# Altium schematic sheet CHIBI_BT_20181126.SchDoc: Title
size A2; PageSetup: Record=PageOptions|CenterHorizontal=True|CenterVertical=True|PrintScale=0.47|XCorrection=1.00|YCorrection=1.00|PrintKind=1|BorderSize=5000000|LeftOffset=0|BottomOffset=0|Orientation=2|PaperLength=1000|PaperWidth=1000|Scale=100|PaperSource=7|PrintQuality=-3|MediaType=1|DitherType=10|PrintScaleMode=1|PaperKind=Letter|PaperIndex=1; ApprovedBy: Enter Name; CheckedBy: Enter Name; DrawnBy: Enter Name; Organization: Tymphany; Address1: 2/F, BBK Building; Address2: No. 89 Ande Street, Shang Meilin; Address3: Futian District, Shenzhen; Address4: GuangDong, P.R.C. 518049, China; DocumentNumber: 3; Revision: 0.0.0; SheetNumber: 3; SheetTotal: 6; ProductName: Product Name; PartNumber: Part Number; ModifiedBy: Enter Name; LeadEngineer: Enter Name; Stage: Concept; DCR: 238m幐嶰WNERINDEX=4425; ProjectName: Project Name
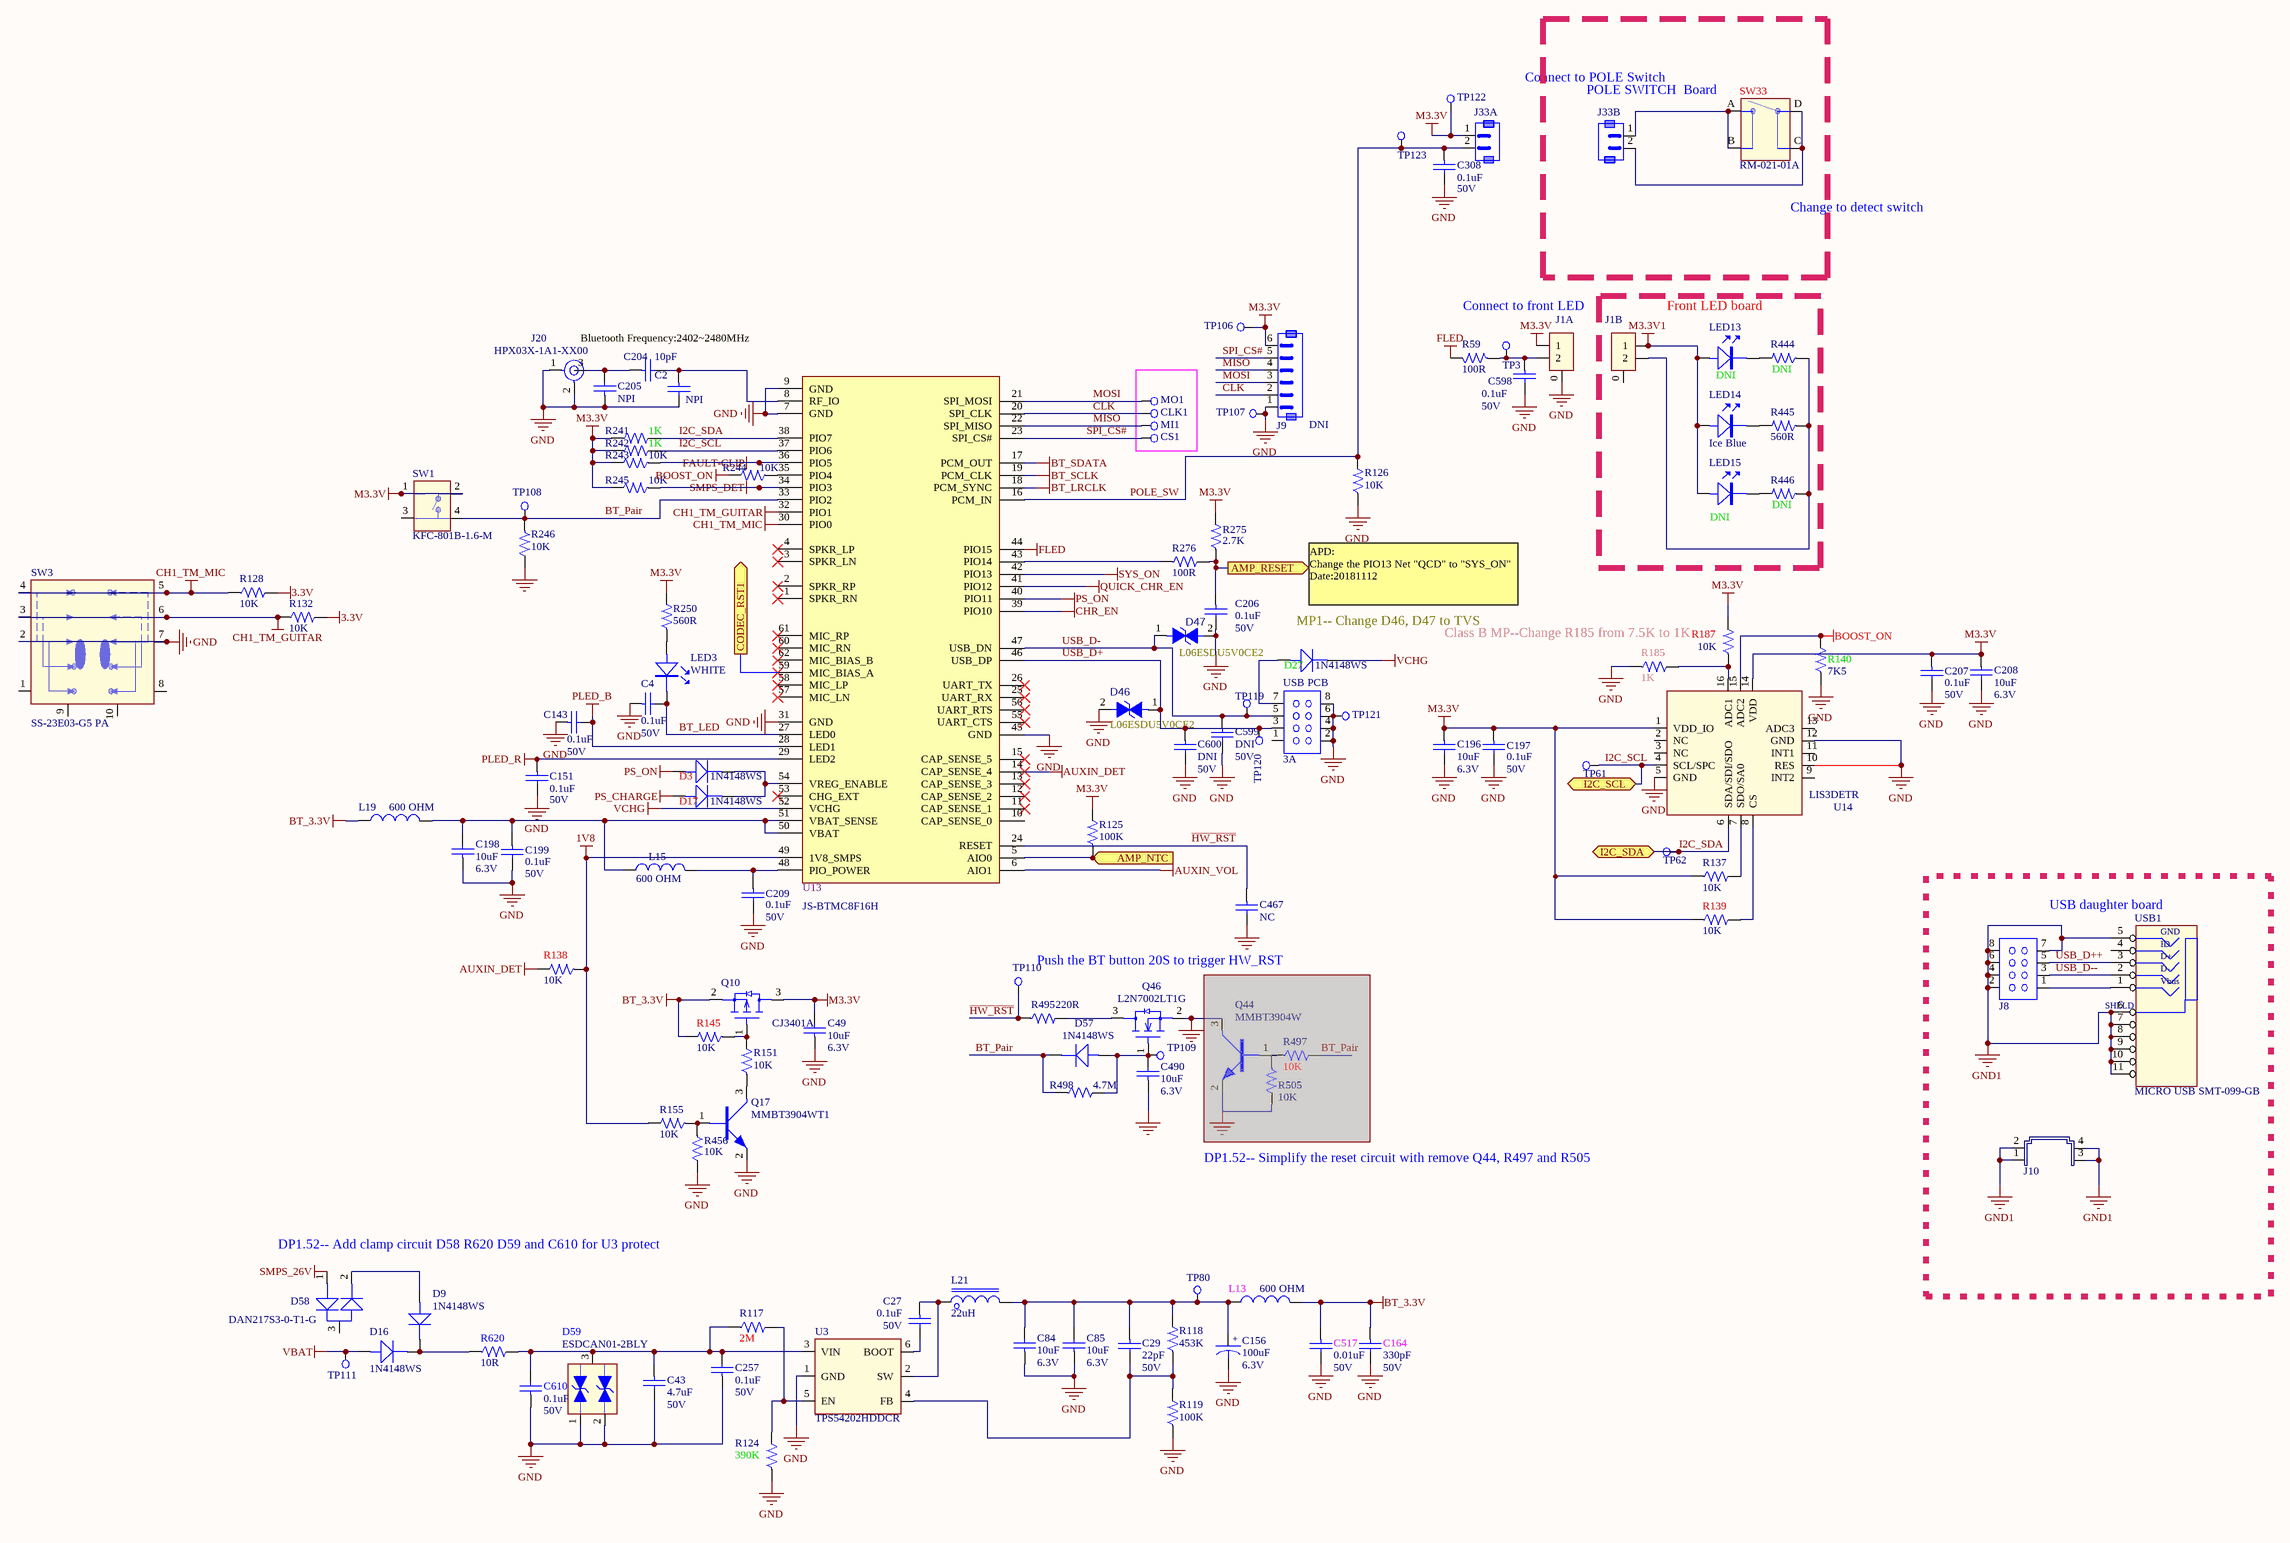
[diagram p0: CHIBI_BT_20181126.SchDoc]

## Parts
C2  value NPI  [CAPC0402-RW]  (hidden comment: PWL410371-1000)
C4  value 0.1uF  Voltage: 50V  [CAPC0402-RW]  (hidden comment: PWL456470-1040)
C27  value 0.1uF  Voltage: 50V  [CAPC0603-RW]  (hidden comment: PXL456470-1040)
C29  value 22pF  Voltage: 50V  [CAPC0402-RW]  (hidden comment: PWL410370-2200)
C43  value 4.7uF  Voltage: 50V  [CAPC0805-RW]  (hidden comment: PYL456470-4750)
C49  value 10uF  Voltage: 6.3V  [CAPC0603-RW]  (hidden comment: PXL426521-1060)
C84  value 10uF  Voltage: 6.3V  [CAPC0603-RW]  (hidden comment: PXL426521-1060)
C85  value 10uF  Voltage: 6.3V  [CAPC0603-RW]  (hidden comment: PXL426521-1060)
C143  value 0.1uF  Voltage: 50V  [CAPC0402-RW]  (hidden comment: PWL456470-1040)
C151  value 0.1uF  Voltage: 50V  [CAPC0402-RW]  (hidden comment: PWL456470-1040)
C156  value 100uF  Voltage: 6.3V  [CASE - C]  (hidden comment: PBE099520-1010)
C164  value 330pF  Voltage: 50V  [CAPC0402-RW]  (hidden comment: PWL410371-3310)
C196  value 10uF  Voltage: 6.3V  [CAPC0603-RW]  (hidden comment: PXL426521-1060)
C197  value 0.1uF  Voltage: 50V  [CAPC0402-RW]  (hidden comment: PWL456470-1040)
C198  value 10uF  Voltage: 6.3V  [CAPC0603-RW]  (hidden comment: PXL426521-1060)
C199  value 0.1uF  Voltage: 50V  [CAPC0402-RW]  (hidden comment: PWL456470-1040)
C204  value 10pF  [CAPC0402-RW]  (hidden comment: PWL410371-1000)
C205  value NPI  [CAPC0402-RW]  (hidden comment: PWL410371-1000)
C206  value 0.1uF  Voltage: 50V  [CAPC0603-RW]  (hidden comment: PXL456470-1040)
C207  value 0.1uF  Voltage: 50V  [CAPC0402-RW]  (hidden comment: PWL456470-1040)
C208  value 10uF  Voltage: 6.3V  [CAPC0603-RW]  (hidden comment: PXL426521-1060)
C209  value 0.1uF  Voltage: 50V  [CAPC0402-RW]  (hidden comment: PWL456470-1040)
C257  value 0.1uF  Voltage: 50V  [CAPC0603-RW]  (hidden comment: PXL456470-1040)
C308  value 0.1uF  Voltage: 50V  [CAPC0402-RW]  (hidden comment: PWL456470-1040)
C467  value NC  [CAPC0402-RW]  (hidden comment: PWL456450-1040)
C490  value 10uF  Voltage: 6.3V  [CAPC0603-RW]  (hidden comment: PXL426521-1060)
C517  value 0.01uF  Voltage: 50V  [CAPC0402-RW]  (hidden comment: PWL456470-1030)
C598  value 0.1uF  Voltage: 50V  [CAPC0402-RW]  (hidden comment: PWL456470-1040)
C599  value DNI  Voltage: 50V  [CAPC0402-RW]  (hidden comment: T54000000484E)
C600  value DNI  Voltage: 50V  [CAPC0402-RW]  (hidden comment: T54000000484E)
C610  value 0.1uF  Voltage: 50V  [CAPC0603-RW]  (hidden comment: PXL456470-1040)
CLK1  TP  [TP_1.5mm]  (value not drawn)
CS1  TP  [TP_1.5mm]  (value not drawn)
D3  RCD114148-0020  [SOD-323]  (value not drawn)
D9  RCD114148-0020  [SOD-323]  (value not drawn)
D16  RCD114148-0020  [SOD-323]  (value not drawn)
D17  RCD114148-0020  [SOD-323]  (value not drawn)
D27  RCD114148-0020  [SOD-323]  (value not drawn)
D46  T593000120100  [SOD882-ESD]  (value not drawn)
D47  T593000120100  [SOD882-ESD]  (value not drawn)
D57  RCD114148-0020  [SOD-323]  (value not drawn)
D58  T572006171251  [SOT323(SC-70)-R]  (value not drawn)
D59  RCD100012-0001  [SOT23-132-RW]  (value not drawn)
J1A  T690300109100  [CONN 2P PH=2.0mm ST SMT PH-2AT-JK]  (value not drawn)
J1B  T690300109100  [CONN 2P PH=2.0mm ST SMT PH-2AT-JK]  (value not drawn)
J8  T690300110000  [HEAD 8P 2X4 PH=2.54mm 90 H5mm_2.54-2X4AW-10.4]  (value not drawn)
J9  value DNI  [CONN 6P PH=1.5mm ST SMT ZH-6AT-JK]  (hidden comment: T690300087900)
J10  T130149800100  [USB BRACKET SPTE NATUR CLEAN]  (value not drawn)
J20  MFG Part: HPX03X-1A1-XX00  [IPEX CONN HPX03X-1A1-XX00]  (hidden comment: COT130017-0001)
J33A  T690300108700  [CONN 2P PH=1.5MM SMT 180 ZH-2AT-JK]  (value not drawn)
J33B  T690300108700  [CONN 2P PH=1.5MM SMT 180 ZH-2AT-JK]  (value not drawn)
L13  Impedence: 600 OHM  [L0402-RW]  (hidden comment: T710500014900)
L15  Impedence: 600 OHM  [L0402-RW]  (hidden comment: T710500014900)
L19  Impedence: 600 OHM  [L0402-RW]  (hidden comment: T710500014900)
L21  value 22uH  [GPSR0550-220M]  (hidden comment: T621000054100)
LED3  Color: WHITE  [LED0603_WHITE]  (hidden comment: KCD900603-0070)
LED13  SAP: DNI  [LED0805-Blue]  (hidden comment: T575011290263)
LED14  Color: Ice Blue  [LED0805-Blue]  (hidden comment: T575011290263)
LED15  SAP: DNI  [LED0805-Blue]  (hidden comment: T575011290263)
MI1  TP  [TP_1.5mm]  (value not drawn)
MO1  TP  [TP_1.5mm]  (value not drawn)
Q10  T585002530466  [SOT23-132-RW]  (value not drawn)
Q17  T581003992440  [SOT323(SC-70)-R]  (value not drawn)
Q44  T581004022460  [SOT323(SC-70)-R]  (value not drawn)  (masked out: inside a compile mask, not in the netlist)
Q46  RCM207002-1001  [SOT23-132-RW]  (value not drawn)
R59  value 100R  [0603-RW]  (hidden comment: QCF011030-1000)
R117  value 2M  [0402-RW]  (hidden comment: T502200401399)
R118  value 453K  [0402-RW]  (hidden comment: T502453301399)
R119  value 100K  [0603-RW]  (hidden comment: QCF011030-1003)
R124  value 390K  [0402-RW]  (hidden comment: QCF161240-3903)
R125  value 100K  [0402-RW]  (hidden comment: QCF161240-1003)
R126  value 10K  [0402-RW]  (hidden comment: QCF161240-1002)
R128  value 10K  [0402-RW]  (hidden comment: QCF161240-1002)
R132  value 10K  [0402-RW]  (hidden comment: QCF161240-1002)
R137  value 10K  [0402-RW]  (hidden comment: QCF161240-1002)
R138  value 10K  [0402-RW]  (hidden comment: QCF161240-1002)
R139  value 10K  [0402-RW]  (hidden comment: QCF161240-1002)
R140  value 7K5  [0402-RW]  (hidden comment: T502750101399)
R145  value 10K  [0402-RW]  (hidden comment: QCF161240-1002)
R151  value 10K  [0402-RW]  (hidden comment: QCF161240-1002)
R155  value 10K  [0402-RW]  (hidden comment: QCF161240-1002)
R185  value 1K  [0402-RW]  (hidden comment: QCF161240-1001)
R187  value 10K  [0402-RW]  (hidden comment: QCF161240-1002)
R241  value 1K  [0402-RW]  (hidden comment: QCF161240-1001)
R242  value 1K  [0402-RW]  (hidden comment: QCF161240-1001)
R243  value 10K  [0402-RW]  (hidden comment: QCF161240-1002)
R244  value 10K  [0402-RW]  (hidden comment: QCF161240-1002)
R245  value 10K  [0402-RW]  (hidden comment: QCF161240-1002)
R246  value 10K  [0402-RW]  (hidden comment: QCF161240-1002)
R250  value 560R  [0603-RW]  (hidden comment: QCF011030-5600)
R275  value 2.7K  [0402-RW]  (hidden comment: QCF161240-2701)
R276  value 100R  [0402-RW]  (hidden comment: QCF161240-1000)
R444  SAP: DNI  [0603-RW]  (hidden comment: QCF011030-5600)
R445  value 560R  [0603-RW]  (hidden comment: QCF011030-5600)
R446  SAP: DNI  [0603-RW]  (hidden comment: QCF011030-5600)
R456  value 10K  [0402-RW]  (hidden comment: QCF161240-1002)
R495  value 220R  [0402-RW]  (hidden comment: QCF161240-2200)
R497  value 10K  [0402-RW]  (hidden comment: QCF161240-1002)  (masked out: inside a compile mask, not in the netlist)
R498  value 4.7M  [0603-RW]  (hidden comment: QCF011030-4704)
R505  value 10K  [0402-RW]  (hidden comment: QCF161240-1002)  (masked out: inside a compile mask, not in the netlist)
R620  value 10R  [0402-RW]  (hidden comment: QCF161241-1009)
SW1  MCWA06007-0010  [KFC-801B-1.6-M]  (value not drawn)
SW3  T670600002700  [SS-23E03-G5 PA]  (value not drawn)
SW33  MFG Part: RM-021-01A  [SW_RM021-01A_DIP]  (hidden comment: T670400000900)
TP3  TP  [TP_1.2mm]  (value not drawn)
TP61  TP  [TP_1.0mm]  (value not drawn)
TP62  TP  [TP_1.0mm]  (value not drawn)
TP80  TP  [TP_1.2mm]  (value not drawn)
TP106  TP  [TP_1.5mm]  (value not drawn)
TP107  TP  [TP_1.5mm]  (value not drawn)
TP108  TP  [TP_1.2mm]  (value not drawn)
TP109  TP  [TP_1.2mm]  (value not drawn)
TP110  TP  [TP_1.2mm]  (value not drawn)
TP111  TP  [TP_1.2mm]  (value not drawn)
TP119  TP  [TP_1.2mm]  (value not drawn)
TP120  TP  [TP_1.2mm]  (value not drawn)
TP121  TP  [TP_1.2mm]  (value not drawn)
TP122  TP  [TP_1.2mm]  (value not drawn)
TP123  TP  [TP_1.2mm]  (value not drawn)
U3  MFG Part: TPS54202HDDCR  [SOT23-6 P.95]  (hidden comment: T611700039022)
U13  MFG Part: JS-BTMC8F16H  [BTM-865]  (hidden comment: WPCA00101-X001/0001)
U14  T610000053015  [LGA-16]  (value not drawn)
USB1  MFG Part: MICRO USB SMT-099-GB  [USB 5P Micro USB SMT-099-GB]  (hidden comment: CJU050001-0003)
USB_PCB  Current: 3A  [HEAD 8P 2X4 PH=2.54mm 180]  (hidden comment: CCP254010-0708)

## Blocks framed on the sheet
Front LED board: J1B LED13-LED15 R444-R446
USB daughter board: J8 J10 USB1

## Ports
AMP_NTC (in), AMP_RESET (out), CODEC_RST1 (out), I2C_SCL (bidir), I2C_SDA (bidir)

## Nets
1V8: R138.1 R155.2 U13.49(1V8_SMPS)
3.3V: R128.2 R132.2
AUXIN_DET: R138.2 U13.14(CAP_SENSE_4)
AUXIN_VOL: U13.6(AIO1)
BOOST_ON: R140.2 R244.2 U14.15(ADC2)
BT_3.3V: C164.1 C517.1 L13.1 L19.2 Q10.2(S) R145.2
BT_LRCLK: U13.18(PCM_SYNC)
BT_SCLK: U13.19(PCM_CLK)
BT_SDATA: U13.17(PCM_OUT)
CH1_TM_GUITAR: R132.1 SW3.3 SW3.6 U13.32(PIO1)
CH1_TM_MIC: R128.1 SW3.4 SW3.5 U13.30(PIO0)
CHR_EN: U13.39(PIO10)
FAULT-CLIP: R243.1 U13.36(PIO5)
FLED: R59.2 U13.44(PIO15)
GND: C2.2 C4.1 C43.2 C49.1 C84.1 C85.1 C143.1 C151.2 C156.2 C164.2 C196.2 C197.2 C198.1 C199.2 C205.1 C206.2 C207.2 C208.2 C209.2 C257.1 C308.2 C467.2 C490.1 C517.2 C598.2 C599.2 C600.2 C610.1 D46.2 D47.2 D59.1(A) D59.2(A) J1A.0 J9.1 J20.1 J20.2 Q17.2(E) Q46.2(S) R119.1 R124.1 R126.1 R140.1 R185.1 R246.2 R456.2 SW3.2 SW3.7 TP107.1 TP121.1 U3.1(GND) U13.7(GND) U13.9(GND) U13.31(GND) U13.45(GND) U14.5(GND) U14.10(RES) U14.12(GND) USB_PCB.2 USB_PCB.4 USB_PCB.6 USB_PCB.8
GND1: J8.2 J8.4 J8.6 J8.7 J8.8 J10.1 J10.2 J10.3 J10.4 USB1.5(GND) USB1.6(SHELD) USB1.7(SHELD) USB1.8(SHELD) USB1.9(SHELD) USB1.10(SHELD) USB1.11(SHELD)
M3.3V: C49.2 C196.1 C197.1 C207.1 C208.1 J1A.1 J9.6 J33A.1 Q10.3(D) R125.2 R137.1 R139.1 R187.2 R241.1 R242.1 R243.2 R245.2 R250.2 R275.2 SW1.1 SW1.2 TP106.1 TP122.1 U14.1(VDD_IO) U14.14(VDD)
M3.3V1: J1B.1 LED13.1(A) LED14.1(A) LED15.1(A)
PLED_B: C143.2 U13.28(LED1)
PLED_R: C151.1 U13.29(LED2)
PS_CHARGE: D17.1(A)
PS_ON: D3.1(A) U13.40(PIO11)
QUICK_CHR_EN: U13.41(PIO12)
SMPS_26V: D58.1(A)
SMPS_DET: R245.1 U13.34(PIO3)
SYS_ON: U13.42(PIO13)
VBAT: D16.1(A) TP111.1
VCHG: D27.2(K) U13.52(VCHG)
AMP_NTC: R125.1 U13.5(AIO0) ; port AMP_NTC
AMP_RESET: C206.1 R275.1 R276.2 ; port AMP_RESET
BT_LED: C4.2 LED3.2(K) U13.27(LED0)
BT_Pair: D57.2(K) R246.1 R498.1 SW1.4 TP108.1 U13.33(PIO2)
CLK: CLK1.1 J9.2 U13.20(SPI_CLK)
CODEC_RST1: U13.59(MIC_BIAS_A) ; port CODEC_RST1
~{HW_RST}: C467.1 R495.1 TP110.1 U13.24(RESET)
I2C_SCL: R242.2 TP61.1 U13.37(PIO6) U14.4(SCL/SPC) ; port I2C_SCL
I2C_SDA: R241.2 TP62.1 U13.38(PIO7) U14.6(SDA/SDI/SDO) ; port I2C_SDA
MISO: J9.4 MI1.1 U13.22(SPI_MISO)
MOSI: J9.3 MO1.1 U13.21(SPI_MOSI)
POLE_SW: C308.1 J33A.2 R126.2 TP123.1 U13.16(PCM_IN)
SPI_CS#: CS1.1 J9.5 U13.23(SPI_CS#)
USB_D+: C600.1 D46.1 TP120.1 U13.46(USB_DP) USB_PCB.3
USB_D++: J8.5 USB1.3(D+)
USB_D-: C599.1 D47.1 TP119.1 U13.47(USB_DN) USB_PCB.5
USB_D--: J8.3 USB1.2(D-)
NetC2_1: C2.1 C204.2 U13.8(RF_IO)
NetC27_1: C27.1 L21.1 U3.2(SW)
NetC27_2: C27.2 U3.6(BOOT)
NetC29_1: C29.1 C84.2 C85.2 C156.1 L13.2 L21.2 R118.2 TP80.1
NetC29_2: C29.2 R118.1 R119.2 U3.4(FB)
NetC43_1: C43.1 C257.2 C610.2 D59.3(K) R117.1 R620.2 U3.3(VIN)
NetC198_2: C198.2 C199.1 L15.2 L19.1 U13.50(VBAT) U13.51(VBAT_SENSE)
NetC204_1: C204.1 C205.2 J20.3
NetC209_1: C209.1 L15.1 U13.48(PIO_POWER)
NetC490_2: C490.2 D57.1(A) Q46.1(G) R498.2 TP109.1
NetC598_1: C598.1 J1A.2 R59.1 TP3.1
NetD3_2: D3.2(K) D17.2(K) U13.54(VREG_ENABLE)
NetD9_1: D9.1(A) D58.2(K)
NetD9_2: D9.2(K) D16.2(K) R620.1
NetD27_1: D27.1(A) USB_PCB.7
NetJ1B_2: J1B.2 R444.1 R445.1 R446.1
NetJ8_1: J8.1 USB1.1(Vbus)
NetJ33B_1: J33B.1 SW33.A SW33.B
NetJ33B_2: J33B.2 SW33.C SW33.D
NetLED3_1: LED3.1(A) R250.1
NetLED13_2: LED13.2(K) R444.2
NetLED14_2: LED14.2(K) R445.2
NetLED15_2: LED15.2(K) R446.2
NetQ10_1: Q10.1(G) R145.1 R151.2
NetQ17_1: Q17.1(B) R155.1 R456.1
NetQ17_3: Q17.3(C) R151.1
NetQ46_3: Q46.3(D) R495.2
NetR117_2: R117.2 R124.2 U3.5(EN)
NetR137_2: R137.2 U14.7(SDO/SA0)
NetR139_2: R139.2 U14.8(CS)
NetR185_2: R185.2 R187.1 U14.16(ADC1)
NetR244_1: R244.1 U13.35(PIO4)
NetR276_1: R276.1 U13.43(PIO14)

Not connected (* = marked no-connect by the designer): D58 3(C); J1B 0; SW1 3; SW3 1 8 9 10; U13 1(SPKR_RN)* 2(SPKR_RP)* 3(SPKR_LN)* 4(SPKR_LP)* 10(CAP_SENSE_0) 11(CAP_SENSE_1)* 12(CAP_SENSE_2)* 13(CAP_SENSE_3)* 15(CAP_SENSE_5)* 25(UART_RX)* 26(UART_TX)* 53(CHG_EXT)* 55(UART_CTS)* 56(UART_RTS)* 57(MIC_LN)* 58(MIC_LP)* 60(MIC_RN)* 61(MIC_RP)* 62(MIC_BIAS_B)*; U14 2(NC) 3(NC) 9(INT2) 11(INT1) 13(ADC3); USB1 4(ID); USB_PCB 1

## Notes on the sheet
- (near TP122) Connect to POLE Switch
- POLE SWITCH  Board
- Change to detect switch
- Connect to front LED
- Bluetooth Frequency:2402~2480MHz
- (near D27) MP1-- Change D46, D47 to TVS
- APD:
  Change the PIO13 Net "QCD" to "SYS_ON"
  Date:20181112
- Class B MP--Change R185 from 7.5K to 1K
- (near TP110) Push the BT button 20S to trigger HW_RST
- DP1.52-- Simplify the reset circuit with remove Q44, R497 and R505
- DP1.52-- Add clamp circuit D58 R620 D59 and C610 for U3 protect
- Version
- Date
- Description of Changes/Notes
- Client
- (Hui Zhou) Co. Ltd., Shenzhen Branch
- Premium Loudspeakers
- Product:
- File Name:
- Page Title:
- CHIBI
- CHIBI Main Board
- Requirement of Tymphany Parts:
  1. Comply with Tymphany QSI057-1031 "Green Product Chemical Substances Specification".
  2. Follow customer's specification as required.
  3. Follow Halogen Free requirement: Br<900 ppm, Cl<900 ppm, Br+Cl< 1500 ppm if required.
- www.Tymphany.com
- Tel: + 86 755-339-121-88
- GuangDong, P.R.C. 518049, China
- Futian District, Shenzhen
- No. 89 Ande Street, Shang Meilin
- 2/F, BBK Building
- Revision:
- Stage:
- Lead Engineer:
- Date:
- Part Number:
- SOP(Ver B)
- 3.1.1
- Sam
- T651000009390
- Drawn By:
- Checked By:
- Time:
- Gavin
- Mod By:
- Approved By:
- Sheet:
- Mod Date:
- Size:
- A2
- of
- Seb
- (in symbol CAP E 100uF 6.3V 20% SMD) +

## Library data of the parts
C2 C205 = CAP0402 10pF 50V 5%: CHIP CAP 5% 50V 0402 NPO 10pF; Vendor Name: NC; Type: Capacitor; CREATE_NAME: TOM@Deftronics; SAP: NPI; PACKAGE: CAPC0402; Vendor Code: *; MFG: *; MFG Part: *; Other: *; Tolerance: 5%; CREATE_TIME: 06-Aug-2013; Voltage: 50V
C4 C143 C151 C197 C199 C207 C209 C308 C598 = CAP0402 0.1uF 50V 10%: CAP, CER, 0.1uF, 10%, 50V, X7R, 0402, RoHS; SAP: T542011047508; Type: Capacitor; CREATE_NAME: TOM@Deftronics; PACKAGE: CAPC0402; Vendor Name: *; MFG: *; MFG Part: *; Other: X7R; Tolerance: 10%; CREATE_TIME: 13-May-2014
C27 = CAP0603 0.1uF 50V 10% - PXL456470-1040: GP CHIP CAP 0.1uF 50V 10% 0603 TYPE X7R; SAP: T542021047508; Vendor Code: 10010262; Type: Capacitor; PACKAGE: CAPC0603; MFG: *; MFG Part: *; Other: X7R; Tolerance: 10%
C29 = CAP0402 22pF 50V 5%: CHIP CAP 5% 50V 0402 NPO 22pF; SAP: T541012206508; Type: Capacitor; CREATE_NAME: GordonL@Deftronics; PACKAGE: CAPC0402; Vendor Code: *; Vendor Name: *; MFG: *; MFG Part: *; Other: NPO; Tolerance: 5%; CREATE_TIME: 08-MAR-2013
C43 = CAP0805 4.7uF 50V 10%: CHIP CAP 4.7uF 50V 10% 0805 TYPE X7R; SAP: T545034757508; Vendor Code: 10010262; Vendor Name: 东莞市晴远电子有限公司; Type: Capacitor; CREAT NAME: Nathan; PACKAGE: CAPC0805; MFG: *; MFG Part: *; Other: X7R; Tolerance: 10%; CREAT TIME: 16-SEP-2015
C49 C84 C85 C196 C198 C208 C490 = CAP0603 10uF 6.3V 20%: CHIP CAP 10uF 6.3V 20% 0603 X5R; SAP: T540000002118; Vendor Code: 10010262; Vendor Name: 东莞市晴远电子有限公司; Type: Capacitor; PACKAGE: CAPC0603; MFG: *; MFG Part: *; Other: X5R; Tolerance: 20%
C156 = CAP E 100uF 6.3V 20% SMD: CHIP ELECT 100uF 6.3V 20% SMD 5x5.3mm; SAP: T551101414000; Vendor Name: 深圳市春明电子有限公司; Vendor Code: 10020343; MFG: 春明电子; Type: Capacitor; PACKAGE: CASE - C; MFG Part: *; Other: *; Tolerance: 20%
C164 = CAP0402 330pF 50V 5%: CHIP CAP WALSIN 5% 50V 0402 NPO 330pF; SAP: T541013316508; CREATE_NAME: GordonL@Deftronics; Type: Capacitor; PACKAGE: CAPC0402; Vendor Code: *; Vendor Name: *; MFG: Walsin; MFG Part: *; Other: NPO; Tolerance: 5%; CREATE_TIME: 19-OCT-2012
C204 = CAP0402 10pF 50V 5%: CHIP CAP 5% 50V 0402 NPO 10pF; SAP: T541011006508; Vendor Name: NC; Type: Capacitor; CREATE_NAME: TOM@Deftronics; PACKAGE: CAPC0402; Vendor Code: *; MFG: *; MFG Part: *; Other: *; Tolerance: 5%; CREATE_TIME: 06-Aug-2013; Voltage: 50V
C206 C257 C610 = CAP0603 0.1uF 50V 10% - PXL456470-1040: GP CHIP CAP 0.1uF 50V 10% 0603 TYPE X7R; SAP: T542021047508; Vendor Code: 10010262; Vendor Name: ???????????; Type: Capacitor; PACKAGE: CAPC0603; MFG: *; MFG Part: *; Other: X7R; Tolerance: 10%
C467 = CAP0402 0.1uF 25V 10%: CHIP CAP 0402 0.1UF/25V X5R 10%; SAP: T542011047408; Type: Capacitor; CREATE_NAME: Evan@Deftronics; Voltage: 25V; PACKAGE: CAPC0402; Vendor Code: *; Vendor Name: *; MFG: *; MFG Part: *; Other: X5R; Tolerance: 10%; CREATE_TIME: 23-Apr-2014
C517 = CAP0402 0.01uF 50V 10%: CAP, CER, 0.01uF, 10%, 50V, X7R, 0402, RoHS; SAP: T542011037508; Type: Capacitor; CREATE_NAME: Evan@Deftronics; PACKAGE: CAPC0402; Vendor Name: *; MFG: *; MFG Part: *; Other: X7R; Tolerance: 10%; CREATE_TIME: 26-May-2014
C599 C600 = CAP0402 10pF 50V_5%_C0G_SAMSUNG: CAP 10PF 50V +-5% 0402C0G SAMSUNG L; Other: C0G; Tolerance: 5%; Type: Capacitor; CREATE_NAME: Nathan; SAP: DNI; PACKAGE: CAPC0402; Vendor Name: *; MFG: SAMSUNG; MFG Part: *; CREATE_TIME: 17-Aug-2016
D3 D9 D16 D17 D27 D57 = 1N4148WS: DIODE SW 1N4148 VF=0.7V SOD-323; MFG: TW SEMICONDUCTOR; SAP: T572005070208; Voltage: 100V; Current: 150MA; Vendor Name: *; Vendor Code: *; Type: DIODE; Package: SOD-323; MFG Part: 1N4148WS
D46 D47 = L06ESDU5V0CE2: TVS 5V L06ESDU5V0CE SMD LITEON L; Type: ESD; CREATE_NAME: Tom; Vendor Code: *; Vendor Name: *; SAP: T593000120100; CREATE_TIME: 24-Feb-2016; MFG: LITEON; MFG Part: L06ESDU5V0CE2
D58 = DAN217S3-0-T1-G: ITC 100V 215MA DAN217S3-0-T1-G CYSTE K; MFG: CYSTECH; Type: DIODES; Create Name: Nathan; SAP: T572006171251; Vendor Name: *; Vendor Code: *; MFG Part: DAN217S3-0-T1-G; Create Time: 08-Sep-2017
D59 = ESDCAN01-2BLY: CHIP DIODE ESD CAN01-2BLY SOT23 24V 5.5A; MFG: ST; SAP: T593000205100; Ppp: 230W; CREATE_NAME: Nathan; Type: ESD DIODE; Ipp: 5.5A; Vendor Code: *; Vendor Name: *; CREATE_TIME: 21-Apr-2015; Vrm: 24V; MFG Part: ESDCAN01-2BLY
J1A J1B = CONN 2P PH=2.0mm ST SMT PH-2AT-JK: CONNECTOR 2P P:2.0MM 90° SMT K; MFG: JINJIA; Value: 2.0mm; CREATE_NAME: Nathan; SAP: T690300109100; Vendor Name: *; Vendor Code: *; MFG Part: PH-2AT-JK; Tolerance: *; Type: Connector; CREATE_TIME: 11-Sep-2017
J8 = HEAD 8P 2X4 PH=2.54mm 90 H5mm_2.54-2X4AW-10.4: 2X4P P:2.54MM 90° DIP K; Value: 2.54mm; MFG: JINJIA; CREAT NAME: Nathan; SAP: T690300110000; MFG Part: 2.54-2X4AW-10.4; Vendor Name: *; Vendor Code: *; Type: Connector; Current: *; CREAT TIME: 12-Sep-2017
J9 = CONN 6P PH=1.5mm ST SMT ZH-6AT-JK: CHIP CONNECTOR 6PIN P:1.5MM 90 G; MFG: 金佳; CREATE_NAME: Nathan; SAP: DNI; MFG Part: ZH-6AT-JK; Vendor Name: *; Vendor Code: *; Type: Connector; CREATE_TIME: 20-OCT-2016; Current: *
J10 = USB BRACKET SPTE NATUR CLEAN: BOOMBOX BRACKET SPTE NATUR CLEAN K; CREATE_NAME: Nathan; Value: *; SAP: T130149800100; MFG: *; MFG Part: BOOMBOX BRACKET; Vendor Name: *; Vendor Code: *; Type: Connector; Current: *; CREATE_TIME: 20-Nov-2017
J20 = IPEX CONN HPX03X-1A1-XX00: SMD IPEX CONNECTOR HPX03X-1A1-XX00; SAP: T690300035700; MFG: 高端; CREATE_NAME: GordonL@Deftronics; Value: *; Vendor Name: *; Vendor Code: *; Type: Connector; CREATE_TIME: 29-MAR-2013; Current: *
J33A J33B = CONN 2P PH=1.5MM SMT 180 ZH-2AT-JK: CONNECTOR 2PIN 1.5MM SMT 90 K; CREATE_NAME: Nathan; MFG: JINJIA; CURRENT: 1.5A; CREATE_TIME: 12-Sep-2017; SAP: T690300108700; MFG Part: ZH-2AT-JK; Vendor Name: *; Vendor code: *; Type: *; Package: *
L13 L15 L19 = BEAD 0402 600OHM_JI100505U-601-PF: BEAD 600OHM 0.3A JI100505U-601-PF G; MFG: SUNLEI; Type: INDUCTOR; IDC: 300mA; CREATE_NAME: Cherry.Chen; SAP: T710500014900; Frequency: *; Vendor Code: *; Vendor Name: *; VALUE: *; MFG Part: JI100505U-601-PF; CREATE_TIME: 27-Feb-2016
L21 = IND 22uH CKST0505-22UH\M: 22UH 2 5A 100K 5.7X CENKER CKST050 K; Type: INDUCTOR; CREATE_NAME: Nathan; Irms: 1.5A; Isat: 2.5A; SAP: T621000054100; MFG: CENKER; Vendor Code: *; Vendor Name: *; Voltage: *; CREATE_TIME: 27-Dec-2017; MFG Part: CKST0505-22UH\M
LED3 = LED0603W: CHIP LED 19-217/T1D-APQHY/3T WHITE 0603  1.6x0.8mm; MFG Part: EVERLIGHT; SAP: T575003410202; CREATE Name: Evan; Package: 0603; Vendor Code: *; Vendor Name: *; MFG: *; Type: LED; CREATE Time: 30-Jun-2014
LED13 LED15 = LED0805B-H-0805AW61B008-Z2: LED 750 2.0X1. H-0805AW61B0 HONGBRIG G; MFG: HONGBRIGHT (弘亮光電); CREAT_NAME: Nathan; Color: Ice Blue; MFG Part: H-0805AW61B008-Z2; Package: 0805; Vendor Code: *; Vendor Name: *; Type: LED; CREAT_TIME: 31-OCT-2016
LED14 = LED0805B-H-0805AW61B008-Z2: LED 750 2.0X1. H-0805AW61B0 HONGBRIG G; MFG: HONGBRIGHT (弘亮光電); CREAT_NAME: Nathan; MFG Part: H-0805AW61B008-Z2; SAP: T575011290263; Package: 0805; Vendor Code: *; Vendor Name: *; Type: LED; CREAT_TIME: 31-OCT-2016
Q10 = CJ3401A: PMOS -30V CJ3401A SOT23 JCET G; CREATE_NAME: Tom; SAP: T585002530466; MFG: JCET; Vendor Code: *; Vendor Name: *; Power: *; Voltage: *; Type: PMOS; Package: SOT-23; CREATE_TIME: 19-Apr-2016; MFG Part: CJ3401A
Q17 = MMBT3904WT1: NPN 40V MMBT3904WT1 SC70 ( ON K; CREATE_NAME: Nathan; SAP: T581003992440; MFG: ON; Vendor Code: *; Vendor Name: *; Voltage: *; Type: NPN; CREATE_TIME: 17-Oct-2017; Current: *; MFG Part: MMBT3904WT1
Q44 = MMBT3904W: NPN 40V MMBT3904W SC70 (SOT323 UMT3) PANJIT K; CREATE_NAME: Tom; SAP: T581004022460; MFG: PANJIT; Vendor Code: *; Vendor Name: *; Voltage: *; Type: NPN; CREATE_TIME: 19-Mar-2016; Current: *; MFG Part: MMBT3904W
Q46 = L2N7002LT1G: CHIP MOSFET 2N7002 SOT-23; SAP: T586001860437; Vendor Code: 10009129; Vendor Name: WING HING ENTERPRISE CO; MFG: LRC; Power: *; Voltage: *; Type: MOSFET; Package: SOT-23; MFG Part: L2N7002LT1G
R59 = RES0603 1/10W 1% 100 OHM: CHIP 100 OHM 100PPM +-1% 0603 WALS L; Vendor Code: 10010262; SAP: T502100002399; Vendor Name: 东莞市晴远电子有限公司; MFG: WALSIN (華新); TOL: 1%; Power: *; MFG Part: *; Type: Resistor; PACKAGE: 0603
R117 = RES0402 1/16W 1% 2M OMH_WALSIN: CHIP 2M OHM    100PPM +-1% 0402 WALS L; TOL: 1%; MFG: WALSIN (華新); Power: 1/16W; CREATE_NAME: Nathan; SAP: T502200401399; Package: 0402; MFG Part: *; Vendor Code: *; Vendor Name: *; Type: Resistor; CREATE_TIME: 25-May-2016
R118 = RES0402 1/16W 1% 453K OMH_WALSIN: CHIP 453K OHM  100PPM +-1% 0402 WALS; TOL: 1%; MFG: WALSIN (華新); Power: 1/16W; CREATE_NAME: Nathan; SAP: T502453301399; Package: 0402; MFG Part: *; Vendor Code: *; Vendor Name: *; Type: Resistor; CREATE_TIME: 25-May-2016
R119 = RES0603 1/10W 1% 100K OHM: GP CHIP RES. 100K OHM 1/10W 1% 0603; Vendor Code: 10010262; SAP: T502100302399; Vendor Name: 东莞市晴远电子有限公司; Power: *; MFG Part: *; MFG: *; TOL: 1%; Type: Resistor; PACKAGE: 0603
R124 = RES0402 1/16W 1% 390K OHM: CHIP RES 390K OHM 1% 1/16W 0402; SAP: T502390301399; CREATE_NAME: GordonL@Deftronics; Vendor Code: *; Power: *; Vendor Name: *; MFG Part: *; MFG: *; TOL: 1%; Type: Resistor; CREATE_TIME: 05-Jan-2013; PACKAGE: 0402
R125 = RES0402 1/16W 1% 100K OHM-QCF161240-1003: CHIP RES 100K OHM 1/16W 1% 0402; SAP: T502100301399; MFG: WALSIN; Vendor Code: *; Power: *; Vendor Name: *; MFG Part: *; TOL: 1%; Type: Resistor; PACKAGE: 0402
R126 R128 R132 R137-R139 R145 R151 R155 R187 R243-R246 R456 R497 R505 = RES0402 1/16W 1% 10K OHM: CHIP RES 10K OHM 1/16W 1% 0402; SAP: T502100201399; MFG: WALSIN; Vendor Code: *; Power: *; Vendor Name: *; MFG Part: *; TOL: 1%; Type: Resistor; PACKAGE: 0402
R140 = RES0402 1/16W 1% 7.5K OMH_WALSIN: CHIP 7.5K OHM  100PPM +-1% 0402 WALS L; TOL: 1%; MFG: WALSIN (華新); Power: 1/16W; CREATE_NAME: Nathan; SAP: T502750101399; Package: 0402; MFG Part: *; Vendor Code: *; Vendor Name: *; Type: Resistor; CREATE_TIME: 25-May-2016
R185 R241 R242 = RES0402 1/16W 1% 1K OHM: CHIP RES 1K OHM 1/16W 1% 0402; SAP: T502100101399; MFG: WALSIN; Vendor Code: *; Power: *; Vendor Name: *; MFG Part: *; TOL: 1%; Type: Resistor; PACKAGE: 0402
R250 R445 = RES0603 1/10W 1% 560 OHM: GP CHIP RES. 560 OHM 1/10W 1% 0603; Vendor Code: 10010262; SAP: T502560002399; Vendor Name: 东莞市晴远电子有限公司; Power: *; MFG Part: *; MFG: *; TOL: 1%; Type: Resistor; PACKAGE: 0603
R275 = RES0402 1/16W 1% 2.7K OHM: CHIP RES 2.7K OHM 1/16W 1% 0402; SAP: T502270101399; MFG: WALSIN; Vendor Code: *; Power: *; Vendor Name: *; MFG Part: *; TOL: 1%; Type: Resistor; PACKAGE: 0402
R276 = RES0402 1/16W 1% 100 OHM: CHIP RES 100 OHM 1/16W 1% 0402; SAP: T502100001399; MFG: WALSIN; Vendor Code: *; Power: *; Vendor Name: *; MFG Part: *; TOL: 1%; Type: Resistor; PACKAGE: 0402
R444 R446 = RES0603 1/10W 1% 560 OHM: GP CHIP RES. 560 OHM 1/10W 1% 0603; Vendor Code: 10010262; Vendor Name: 东莞市晴远电子有限公司; Value: 560R; Power: *; MFG Part: *; MFG: *; TOL: 1%; Type: Resistor; PACKAGE: 0603
R495 = RES0402 1/16W 1% 220 OHM: CHIP RES 220 OHM 1/16W 1% 0402; SAP: T502220001399; MFG: WALSIN; Vendor Code: *; Power: *; Vendor Name: *; MFG Part: *; TOL: 1%; Type: Resistor; PACKAGE: 0402
R498 = RES0603 1/10W 1% 4.7M OHM: CHIP RES 4.7M OHM 1/10W 1% 0603; Vendor Code: 10010262; SAP: T502470402399; Vendor Name: 东莞市晴远电子有限公司; Power: *; MFG Part: *; MFG: *; TOL: 1%; Type: Resistor; PACKAGE: 0603
R620 = RES0402 1/16W 1% 10 OHM: CHIP RES 10 OHM 1/16W 1% 0402; SAP: T502100A01399; MFG: WALSIN; Vendor Code: *; Power: *; Vendor Name: *; MFG Part: *; TOL: 1%; Type: Resistor; PACKAGE: 0402
SW1 = KFC-801B-1.6-M: TACT SWITCH 50mA 12VDC KFC-801B-1.6-M; SAP: T670200002100; MFG: 深圳罡坚; Voltage: 12V; Vendor Code: *; Vendor Name: *; Value: TACT; Current: 50mA; Type: Switch; MFG Part: KFC-801B-1.6-M
SW3 = SS-23E03-G5 PA: SLIDE SWITCH 8P SS-23E03-G PA K; MFG: C&K; Value: 2P3T; Voltage: 50V; CREATE_NAME: Nathan; SAP: T670600002700; Vendor Code: *; Vendor Name: *; Current: *; Type: Switch; CREATE_TIME: 15-Mar-2017; MFG Part: SS-23E03-G5 PA
SW33 = SENSOR SW RM021-01A: DIP SWITCH 12V 1MA K; MFG: 创恩; CREATE_NAME: Nathan; SAP: T670400000900; Vendor Code: *; Vendor Name: *; Type: Switch; CREATE_TIME: 20-Feb-2017; Current: 1mA; Voltage: 12V
U3 = TPS54202: DC DC CVT TPS54202HDD SOT-23(6) TI K; CREATE_NAME: Nathan; MFG: TI; SAP: T611700039022; Vendor Code: *; Vendor Name: *; Package: SOT23-6; CREATE_TIME: 09-Sep-2016
U13 = BTM865-CA9_BOSE CHIBI: BOSE CHIBI CSR8670 K; SAP: T710300021700; MFG: RAYSON; CREATE_NAME: Nathan; Vendor Code: *; Vendor Name: *; CREATE_TIME: 12-Sep-2017; Type: BLUETOOTH
U14 = LIS3DETR: SP LIS3DE LGA-16 ST      G; CREATE_NAME: Nathan; MFG: ST; Vendor Code: *; Vendor Name: *; SAP: T610000053015; Type: IC; CREATE_TIME: 17-Jun-2016; MFG Part: LIS3DETR
USB1 = USB 5P Micro USB SMT-099-GB: SMD Micro USB JACK 180' MUB BF SMT-099-GB; MFG: 高端电子; SAP: T690300021500; Current: 1A; CREATE_NAME: GordonL@Deftronics; Value: *; Vendor Name: *; Vendor Code: *; CREATE_TIME: 19-Dec-2013; Type: Connector
USB_PCB = HEAD 8P 2X4 PH=2.54mm 180: HEAD PIN 8P 180' DUAL PIN P2.54*H11.5mm 2X4; Value: DNP, DUMMY PAD; SAP: DNP; Vendor Name: 亿源电子有限公司; Vendor Code: 10009989; MFG: *; MFG Part: *; Type: Connector